# Altium project MotorCtrl.PrjPcb
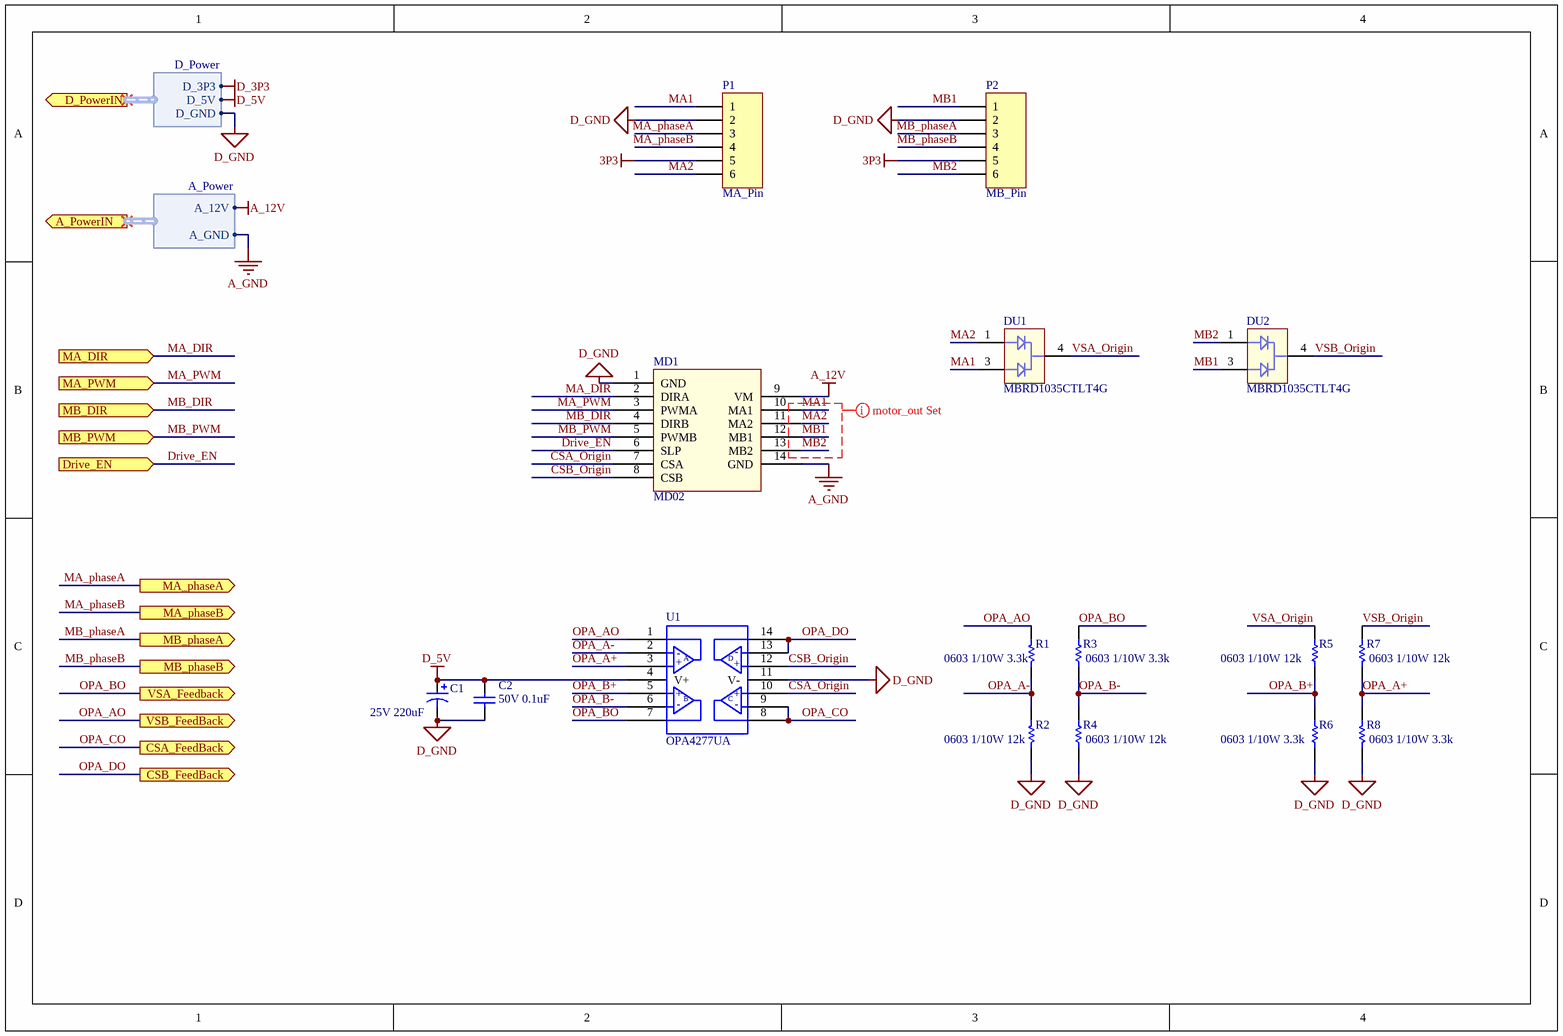
[diagram p0: MotorCtrl.SchDoc]
1 sheet, 16 parts. Net scope: flat (ports and power ports of the same name join across sheets).
Board file: MotorCtrl.PcbDoc

## Sheet MotorCtrl.SchDoc
size A4; Organization: Altium Limited; Address1: L3, 12a Rodborough Rd; Address2: Frenchs Forest; Address3: NSW; Address4: Australia 2086; SheetNumber: 1; SheetTotal: 1; SPICEModelCacheSOUJEWZH: <root> / <DocumentId>SOUJEWZH</DocumentId> / </root>

### Parts
C1  25V 220uF  [VZT221M1ETR-0607]
C2  50V 0.1uF  [0603F104M500NT]
DU1  MBRD1035CTLT4G  [MBRD1035CTLT4G]
DU2  MBRD1035CTLT4G  [MBRD1035CTLT4G]
MD1  MD02  [MOTOR_DRIVER]
P1  MA_Pin  [S6B-XH-A]
P2  MB_Pin  [S6B-XH-A]
R1  0603 1/10W 3.3k  [0603WAF3301T5E]
R2  0603 1/10W 12k  [PTFR0603B12K0N9]
R3  0603 1/10W 3.3k  [0603WAF3301T5E]
R4  0603 1/10W 12k  [PTFR0603B12K0N9]
R5  0603 1/10W 12k  [PTFR0603B12K0N9]
R6  0603 1/10W 3.3k  [0603WAF3301T5E]
R7  0603 1/10W 12k  [PTFR0603B12K0N9]
R8  0603 1/10W 3.3k  [0603WAF3301T5E]
U1  OPA4277UA  [OPA4277UA]

### Ports
A_PowerIN (out, harness A_Power), CSA_FeedBack (out), CSB_FeedBack (out), D_PowerIN (out, harness D_Power), Drive_EN (in), MA_DIR (in), MA_phaseA (out), MA_phaseB (out), MA_PWM (in), MB_DIR (in), MB_phaseA (out), MB_phaseB (out), MB_PWM (in), VSA_Feedback (out), VSB_FeedBack (out)

### Harnesses
D_Power: D_3P3, D_5V, D_GND
A_Power: A_12V, A_GND

### Nets
3P3: P1.5 P2.5
A_12V: MD1.9(VM) ; port A_PowerIN.A_12V
A_GND: MD1.14(GND) ; port A_PowerIN.A_GND
D_3P3: port D_PowerIN.D_3P3
D_5V: C1.1 C2.2 U1.4(V+) ; port D_PowerIN.D_5V
D_GND: C1.2 C2.1 MD1.1(GND) P1.2 P2.2 R2.1 R4.1 R6.2 R8.2 U1.11(V-) ; port D_PowerIN.D_GND
CSA_Origin: MD1.7(CSA) U1.10(+in_C)
CSB_Origin: MD1.8(CSB) U1.12(+In_D)
Drive_EN: MD1.6(SLP) ; port Drive_EN
MA1: DU1.3 MD1.10(MA1) P1.1
MA2: DU1.1 MD1.11(MA2) P1.6
MA_DIR: MD1.2(DIRA) ; port MA_DIR
MA_phaseA: P1.3 ; port MA_phaseA
MA_phaseB: P1.4 ; port MA_phaseB
MA_PWM: MD1.3(PWMA) ; port MA_PWM
MB1: DU2.3 MD1.12(MB1) P2.1
MB2: DU2.1 MD1.13(MB2) P2.6
MB_DIR: MD1.4(DIRB) ; port MB_DIR
MB_phaseA: P2.3 ; port MB_phaseA
MB_phaseB: P2.4 ; port MB_phaseB
MB_PWM: MD1.5(PWMB) ; port MB_PWM
OPA_A+: R7.2 R8.1 U1.3(+In_A)
OPA_A-: R1.1 R2.2 U1.2(-In_A)
OPA_AO: R1.2 U1.1(Out_A) ; port VSB_FeedBack
OPA_B+: R5.2 R6.1 U1.5(+In_B)
OPA_B-: R3.1 R4.2 U1.6(-In_B)
OPA_BO: R3.2 U1.7(Out_B) ; port VSA_Feedback
OPA_CO: U1.8(Out_C) U1.9(-In_C) ; port CSA_FeedBack
OPA_DO: U1.13(-In_D) U1.14(Out_D) ; port CSB_FeedBack
VSA_Origin: DU1.4 R5.1
VSB_Origin: DU2.4 R7.1

### Layout directives
net class motor_out; rule Clearance Constraint [Generic clearance = 0.65mm, and 9 value(s) for objects]; rule Width Constraint [Pref Width = 0.381mm    Min Width = 0.254mm    Max Width = 0.381mm]; rule Routing Via Style [Pref Size = 20mil    Pref Hole Size = 10mil]: MA1, MA2, MB1, MB2

### Notes on the sheet
- Title
- Size:
- Date:
- A4
- Number:
- Time:
- Revision:
- Sheet
- of
- File:
- (in symbol Small Signal Amplifier) －; A; D; +; B; C

### Library data of the parts
C1 = Cap Pol1: -45℃~+105℃ 2000hrs@105℃ 220uF 7.7mm 25V 6.3mm ±20% SMD,6.3x7.7mm Aluminum Electrolytic Capacitors - SMD ROHS; Value: 1000uF; Published: 8-Jun-2000; LatestRevisionDate: 17-Jul-2002; LatestRevisionNote: Re-released for DXP Platform.; PackageReference: RB7.6-15; Publisher: Altium Limited; PackageDescription: Polarized Capacitor (Radial); 2 Leads; ComponentLink1Description: buy_link; ComponentLink1URL: https://shopee.tw/(%E5%85%83%E8%80%80)-%E7%9B%B4%E6%8F%92-%E9%9B%BB%E8%A7%A3%E9%9B%BB%E5%AE%B9-47uF~1000uF-16V~50V-%E9%AB%94%E7%A9%8D-8*14.5mm~10*19.5mm(5%E9%A1%86%E4%B8%80%E6%A8%99)-i.140576581.2524079905?sp_atk=ccd45567-e386-4bfb-a6e8-2480335a57a5
C2 = Cap Semi: 50V 100nF Y5V ±20% 0603 Multilayer Ceramic Capacitors MLCC - SMD/SMT ROHS; Value: 1uF; Published: 8-Jun-2000; LatestRevisionDate: 29-May-2009; LatestRevisionNote: IPC-7351 Footprint Added.; PackageReference: C1206; Publisher: Altium Limited; PackageDescription: Chip Capacitor
DU1 DU2 = MBRD1035CTLT4G: 35V 470mV@5A 5A TO-252-2(DPAK) Schottky Barrier Diodes (SBD) ROHS; buy_link: https://www.ruten.com.tw/item/show?21744290003226; datasheet: https://datasheet.ciiva.com/905/mbrd1035ctl-d-905952.pdf?src-supplier=Digi-Key
MD1 = Motor Driver: 17A 2 Cheel Motor Driver; buy_link: https://www.ruten.com.tw/item/show?21811773783671
P1 P2 = Header 6: S6B-XH-A; LatestRevisionDate: 17-Jul-2002; LatestRevisionNote: Re-released for DXP Platform.; Publisher: Altium Limited
R1 R3 R6 R8 = Res1: ±1% 1/10W Thick Film Resistors 75V ±100ppm/℃ -55℃~+155℃ 3.3kΩ 0603 Chip Resistor - Surface Mount ROHS; Published: 8-Jun-2000; LatestRevisionDate: 17-Jul-2002; LatestRevisionNote: Re-released for DXP Platform.; PackageReference: AXIAL-0.3; Publisher: Altium Limited; PackageDescription: Axial Device, Thru-Hole; 2 Leads; 0.3 in Pin Spacing
R2 R4 R5 R7 = Res1: ±0.1% 100mW Thin Film Resistor 100V ±10ppm/℃ 12kΩ -55℃~+125℃ 0603 Chip Resistor - Surface Mount ROHS; Published: 8-Jun-2000; LatestRevisionDate: 17-Jul-2002; LatestRevisionNote: Re-released for DXP Platform.; PackageReference: AXIAL-0.3; Publisher: Altium Limited; PackageDescription: Axial Device, Thru-Hole; 2 Leads; 0.3 in Pin Spacing
U1 = Small Signal Amplifier: buy_link: https://www.ruten.com.tw/item/show?22015419000992; datasheet: https://datasheet.ciiva.com/27050/905643-27050822.pdf?src-supplier=Jameco